# Altium schematic sheet SheetFINAL.SchDoc
size C
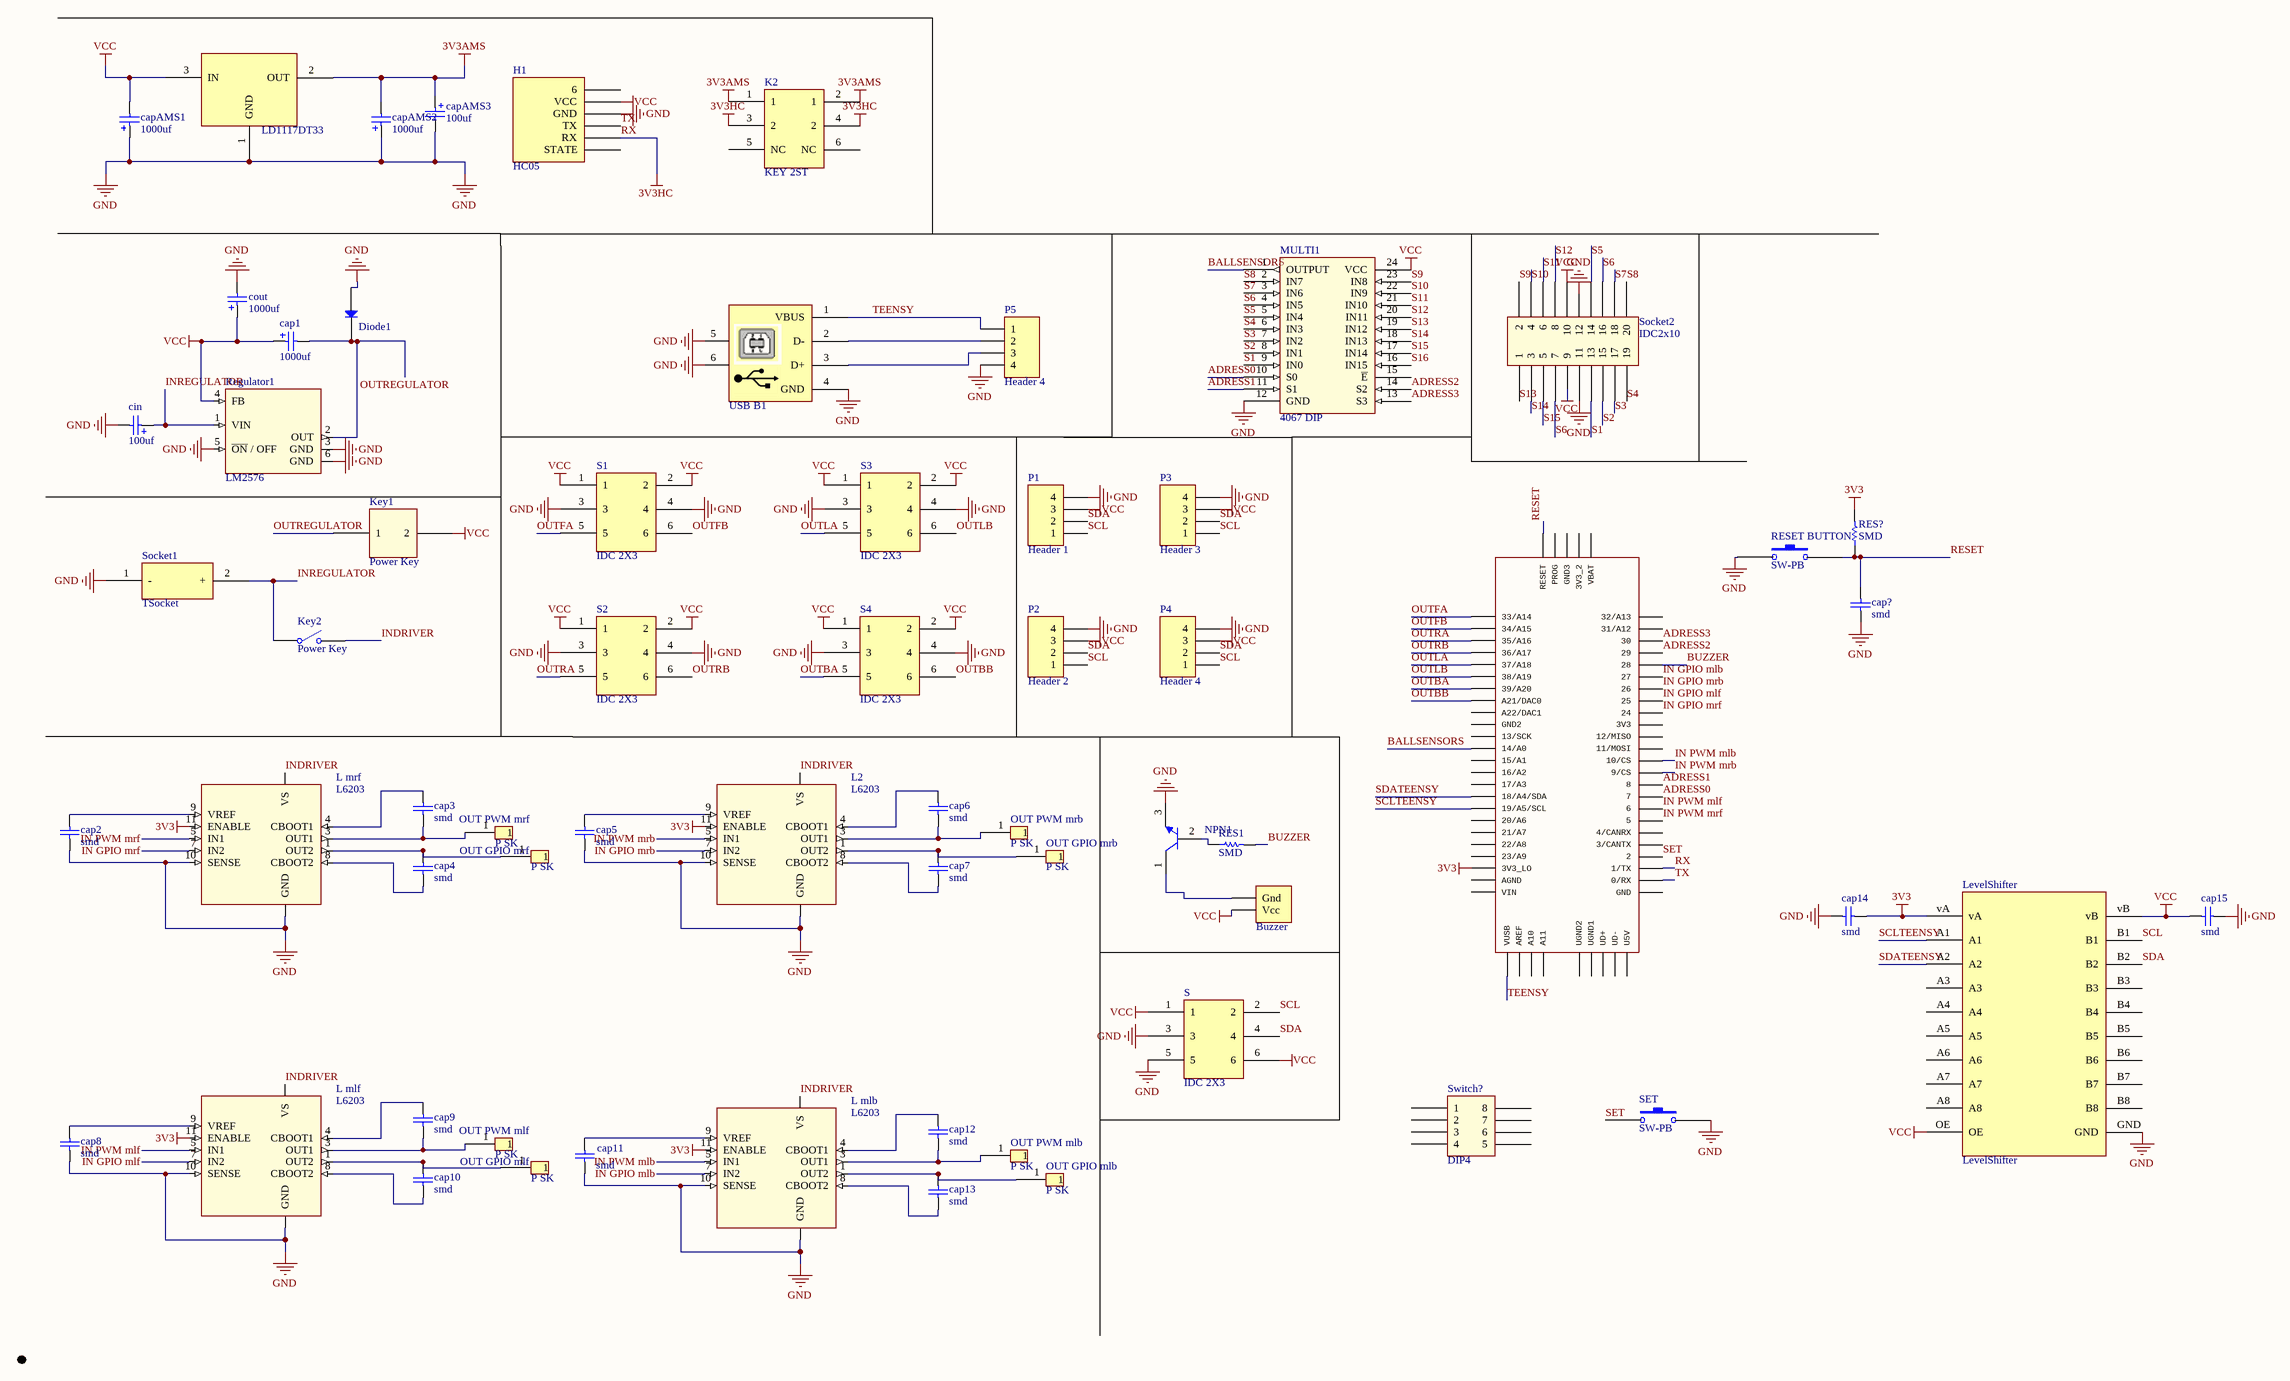
[diagram p0: SheetFINAL.SchDoc]

## Parts
1  TEENSY_3.5/3.6  [TEENSY_3.5/3.6]  (value not drawn)
?  LD1117DT33  [SOT223]
Buzzer  Buzzer  [Buzzer]  (value not drawn)
cap1  1000uf  [Cap 1000uf]
cap2  smd  [Cap SMD]
cap3  smd  [Cap SMD]
cap4  smd  [Cap SMD]
cap5  smd  [Cap SMD]
cap6  smd  [Cap SMD]
cap7  smd  [Cap SMD]
cap8  smd  [Cap SMD]
cap9  smd  [Cap SMD]
cap10  smd  [Cap SMD]
cap11  smd  [Cap SMD]
cap12  smd  [Cap SMD]
cap13  smd  [Cap SMD]
cap14  smd  [Cap SMD]
cap15  smd  [Cap SMD]
cap?  smd  [Cap SMD]
capAMS1  1000uf  [Cap 1000uf]
capAMS2  1000uf  [Cap 1000uf]
capAMS3  100uf  [Cap 100uF]
cin  100uf  [Cap 100uF]
cout  1000uf  [Cap 1000uf]
Diode1  Diode  [Diode]  (value not drawn)
H1  HC05  [HC05]
K2  KEY 2ST  [KEY 2ST]
Key1  Power Key  [Power Key]
Key2  Power Key  [Power Key]
L2  L6203  [MultiWatt11]
L_mlb  L6203  [MultiWatt11]
L_mlf  L6203  [MultiWatt11]
L_mrf  L6203  [MultiWatt11]
LevelShifter  LevelShifter  [CJMCU]
MULTI1  4067 DIP  [4067 DIP]
NPN1  N2222A  [NPN]  (value not drawn)
OUT_GPIO_mlb  P SK  [P SK]
OUT_GPIO_mlf  P SK  [P SK]
OUT_GPIO_mrb  P SK  [P SK]
OUT_GPIO_mrf  P SK  [P SK]
OUT_PWM_mlb  P SK  [P SK]
OUT_PWM_mlf  P SK  [P SK]
OUT_PWM_mrb  P SK  [P SK]
OUT_PWM_mrf  P SK  [P SK]
P1  Header 1  [HDR1X4]
P2  Header 2  [HDR1X4]
P3  Header 3  [HDR1X4]
P4  Header 4  [HDR1X4]
P5  Header 4  [HDR1X4]
Regulator1  LM2576  [D2PAK]
RES1  SMD  [Resistor SMD 1206]
RES?  SMD  [Resistor SMD 1206]
RESET_BUTTON  SW-PB  [SW_2pin]
S  IDC 2X3  [IDC 2X3]
S1  IDC 2X3  [IDC 2X3]
S2  IDC 2X3  [IDC 2X3]
S3  IDC 2X3  [IDC 2X3]
S4  IDC 2X3  [IDC 2X3]
SET  SW-PB  [SW_2pin]
Socket1  TSocket  [TSocket]
Socket2  IDC2x10  [IDC 2x10]
Switch?  DIP4  [DIP SW4]
USB_B1  USB_B  [USB_B.1]  (value not drawn)

## Nets
3V3: 1.3V3_LO cap14.2 L2.11(ENABLE) L_mlb.11(ENABLE) L_mlf.11(ENABLE) L_mrf.11(ENABLE) LevelShifter.vA RES?.2
3V3AMS: ?.2(OUT) capAMS2.2 capAMS3.1 K2.1 K2.2(1)
GND: ?.1(GND) cap2.1 cap5.1 cap8.1 cap11.1 cap14.1 cap15.2 cap?.2 capAMS1.1 capAMS2.1 capAMS3.2 cin.2 cout.2 Diode1.1(A) H1.4(GND) L2.6(GND) L2.10(SENSE) L_mlb.6(GND) L_mlb.10(SENSE) L_mlf.6(GND) L_mlf.10(SENSE) L_mrf.6(GND) L_mrf.10(SENSE) LevelShifter.GND MULTI1.12(GND) NPN1.3(E) P1.4 P2.4 P3.4 P4.4 P5.4 Regulator1.3(GND) Regulator1.5(~{ON}_/_OFF) Regulator1.6(GND) RESET_BUTTON.2 S.3 S.5 S1.3 S1.4 S2.3 S2.4 S3.3 S3.4 S4.3 S4.4 SET.1 Socket1.1(-) Socket2.11 USB_B1.4(GND) USB_B1.5 USB_B1.6
RX: 1.1/TX H1.2(RX) K2.3(2) K2.4(2)  [also labelled 3V3HC]
VCC: ?.3(IN) Buzzer.1(Vcc) cap1.1 cap15.1 capAMS1.2 cout.1 H1.5(VCC) Key1.2 LevelShifter.OE LevelShifter.vB MULTI1.24(VCC) P1.3 P2.3 P3.3 P4.3 Regulator1.4(FB) S.1 S.6 S1.1 S1.2 S2.1 S2.2 S3.1 S3.2 S4.1 S4.2 Socket2.9 Socket2.10
ADRESS0: 1.7 MULTI1.10(S0)
ADRESS1: 1.8 MULTI1.11(S1)
ADRESS2: 1.29 MULTI1.14(S2)
ADRESS3: 1.30 MULTI1.13(S3)
BALLSENSORS: 1.14/A0 MULTI1.1(OUTPUT)
BUZZER: 1.28 RES1.2
IN GPIO mlb: 1.27 L_mlb.7(IN2)
IN GPIO mlf: 1.25 L_mlf.7(IN2)
IN GPIO mrb: 1.26 L2.7(IN2)
IN GPIO mrf: 1.24 L_mrf.7(IN2)
IN PWM mlb: 1.10/CS L_mlb.5(IN1)
IN PWM mlf: 1.6 L_mlf.5(IN1)
IN PWM mrb: 1.9/CS L2.5(IN1)
IN PWM mrf: 1.5 L_mrf.5(IN1)
INDRIVER: Key2.2(NO) L2.2(VS) L_mlb.2(VS) L_mlf.2(VS) L_mrf.2(VS)
INREGULATOR: cin.1 Key2.1(COMMON) Regulator1.1(VIN) Socket1.2(+)
OUTBA: 1.39/A20 S4.5
OUTBB: 1.21/DAC0(A21/DAC0) S4.6
OUTFA: 1.33/A14 S1.5
OUTFB: 1.34/A15 S1.6
OUTLA: 1.37/A18 S3.5
OUTLB: 1.38/A19 S3.6
OUTRA: 1.35/A16 S2.5
OUTRB: 1.36/A17 S2.6
OUTREGULATOR: cap1.2 Diode1.2(K) Key1.1 Regulator1.2(OUT)
RESET: 1.RESET cap?.1 RES?.1 RESET_BUTTON.1
S1: MULTI1.9(IN0) Socket2.13
S2: MULTI1.8(IN1) Socket2.15
S3: MULTI1.7(IN2) Socket2.17
S4: MULTI1.6(IN3) Socket2.19
S5: MULTI1.5(IN4) Socket2.14
S6: MULTI1.4(IN5) Socket2.7 Socket2.16
S7: MULTI1.3(IN6) Socket2.18
S8: MULTI1.2(IN7) Socket2.20
S9: MULTI1.23(IN8) Socket2.2
S10: MULTI1.22(IN9) Socket2.4
S11: MULTI1.21(IN10) Socket2.6
S12: MULTI1.20(IN11) Socket2.8
S13: MULTI1.19(IN12) Socket2.1
S14: MULTI1.18(IN13) Socket2.3
S15: MULTI1.17(IN14) Socket2.5
S16: MULTI1.16(IN15)
SCL: LevelShifter.B1 P1.1 P2.1 P3.1 P4.1 S.2
SCLTEENSY: 1.19/A5/SCL LevelShifter.A1
SDA: LevelShifter.B2 P1.2 P2.2 P3.2 P4.2 S.4
SDATEENSY: 1.18/A4/SDA LevelShifter.A2
SET: 1.2 SET.2
TEENSY: 1.VUSB P5.1 USB_B1.1(VBUS)
TX: 1.0/RX H1.3(TX)
NetBuzzer_2: Buzzer.2(Gnd) NPN1.1(C)
Netcap2_2: cap2.2 L_mrf.9(VREF)
Netcap3_1: cap3.1 L_mrf.3(OUT1) OUT_PWM_mrf.1
Netcap3_2: cap3.2 L_mrf.4(CBOOT1)
Netcap4_1: cap4.1 L_mrf.8(CBOOT2)
Netcap4_2: cap4.2 L_mrf.1(OUT2) OUT_GPIO_mrf.1
Netcap5_2: cap5.2 L2.9(VREF)
Netcap6_1: cap6.1 L2.3(OUT1) OUT_PWM_mrb.1
Netcap6_2: cap6.2 L2.4(CBOOT1)
Netcap7_1: cap7.1 L2.8(CBOOT2)
Netcap7_2: cap7.2 L2.1(OUT2) OUT_GPIO_mrb.1
Netcap8_2: cap8.2 L_mlf.9(VREF)
Netcap9_1: cap9.1 L_mlf.3(OUT1) OUT_PWM_mlf.1
Netcap9_2: cap9.2 L_mlf.4(CBOOT1)
Netcap10_1: cap10.1 L_mlf.8(CBOOT2)
Netcap10_2: cap10.2 L_mlf.1(OUT2) OUT_GPIO_mlf.1
Netcap11_2: cap11.2 L_mlb.9(VREF)
Netcap12_1: cap12.1 L_mlb.3(OUT1) OUT_PWM_mlb.1
Netcap12_2: cap12.2 L_mlb.4(CBOOT1)
Netcap13_1: cap13.1 L_mlb.8(CBOOT2)
Netcap13_2: cap13.2 L_mlb.1(OUT2) OUT_GPIO_mlb.1
NetNPN1_2: NPN1.2(B) RES1.1
NetP5_2: P5.2 USB_B1.2(D-)
NetP5_3: P5.3 USB_B1.3(D+)

Not connected (* = marked no-connect by the designer): 1 3/CANTX 3V3 3V3_2 4/CANRX 11/MOSI 12/MISO 13/SCK 15/A1 16/A2 17/A3 20/A6 21/A7 22/A8 23/A9 31/A12 32/A13 A10 A11 A22/DAC1 AGND AREF GND GND2 GND3 PROG U5V UD+ UD- UGND1 UGND2 VBAT VIN; H1 1(STATE) 6; K2 5(NC) 6(NC); LevelShifter A3 A4 A5 A6 A7 A8 B3 B4 B5 B6 B7 B8; MULTI1 15(~{E}); Socket2 12; Switch? 1 2 3 4 5 6 7 8

## Notes on the sheet
- Labels drawn without touching a wire or pin: GND

## Library data of the parts
1 = TEENSY_3.5/3.6: GateName_1: G$1; SymbolName_1: TEENSY_3.5/3.6; LibraryName: Teensy356; DeviceSetName: TEENSY_3.5/3.6; Package: TEENSY_3.5/3.6
cap1 capAMS1 capAMS2 cout = Cap 1000uF
cap2-cap15 cap? = Cap SMD
capAMS3 cin = Cap 100uF
NPN1 = NPN
P1-P5 = Header 4: Header, 4-Pin; LatestRevisionDate: 17-Jul-2002; LatestRevisionNote: Re-released for DXP Platform.; Publisher: Altium Limited
RES1 RES? = Res SMD
RESET_BUTTON SET = SW-PB: Switch; Published: 24-Mar-1999; LatestRevisionDate: 17-Jul-2002; LatestRevisionNote: Re-released for DXP Platform.; PackageReference: SPST-2; Publisher: Altium Limited; PackageDescription: Switch; 2 Leads
Socket2 = IDC 2x10
Switch? = DIP SW 4
USB_B1 = USB_B: USB B; LatestRevisionDate: 17-Jul-2002; LatestRevisionNote: Re-released for DXP Platform.; Publisher: Altium Limited